# Altium project MSXIV_Rear_Power_Distribution.PrjPcb (part 5 of 5)

## Sheet Power Distribution -  Rear Camera and Charger.SchDoc: Title
size B; Organization: Midnight Sun Solar Rayce Car Team; Address1: University of Waterloo; Address2: 200 University Ave W; Address3: Waterloo, ON, Canada; Address4: N2L 3E9; Website: www.uwmidsun.com; ProjectName: ProjectName
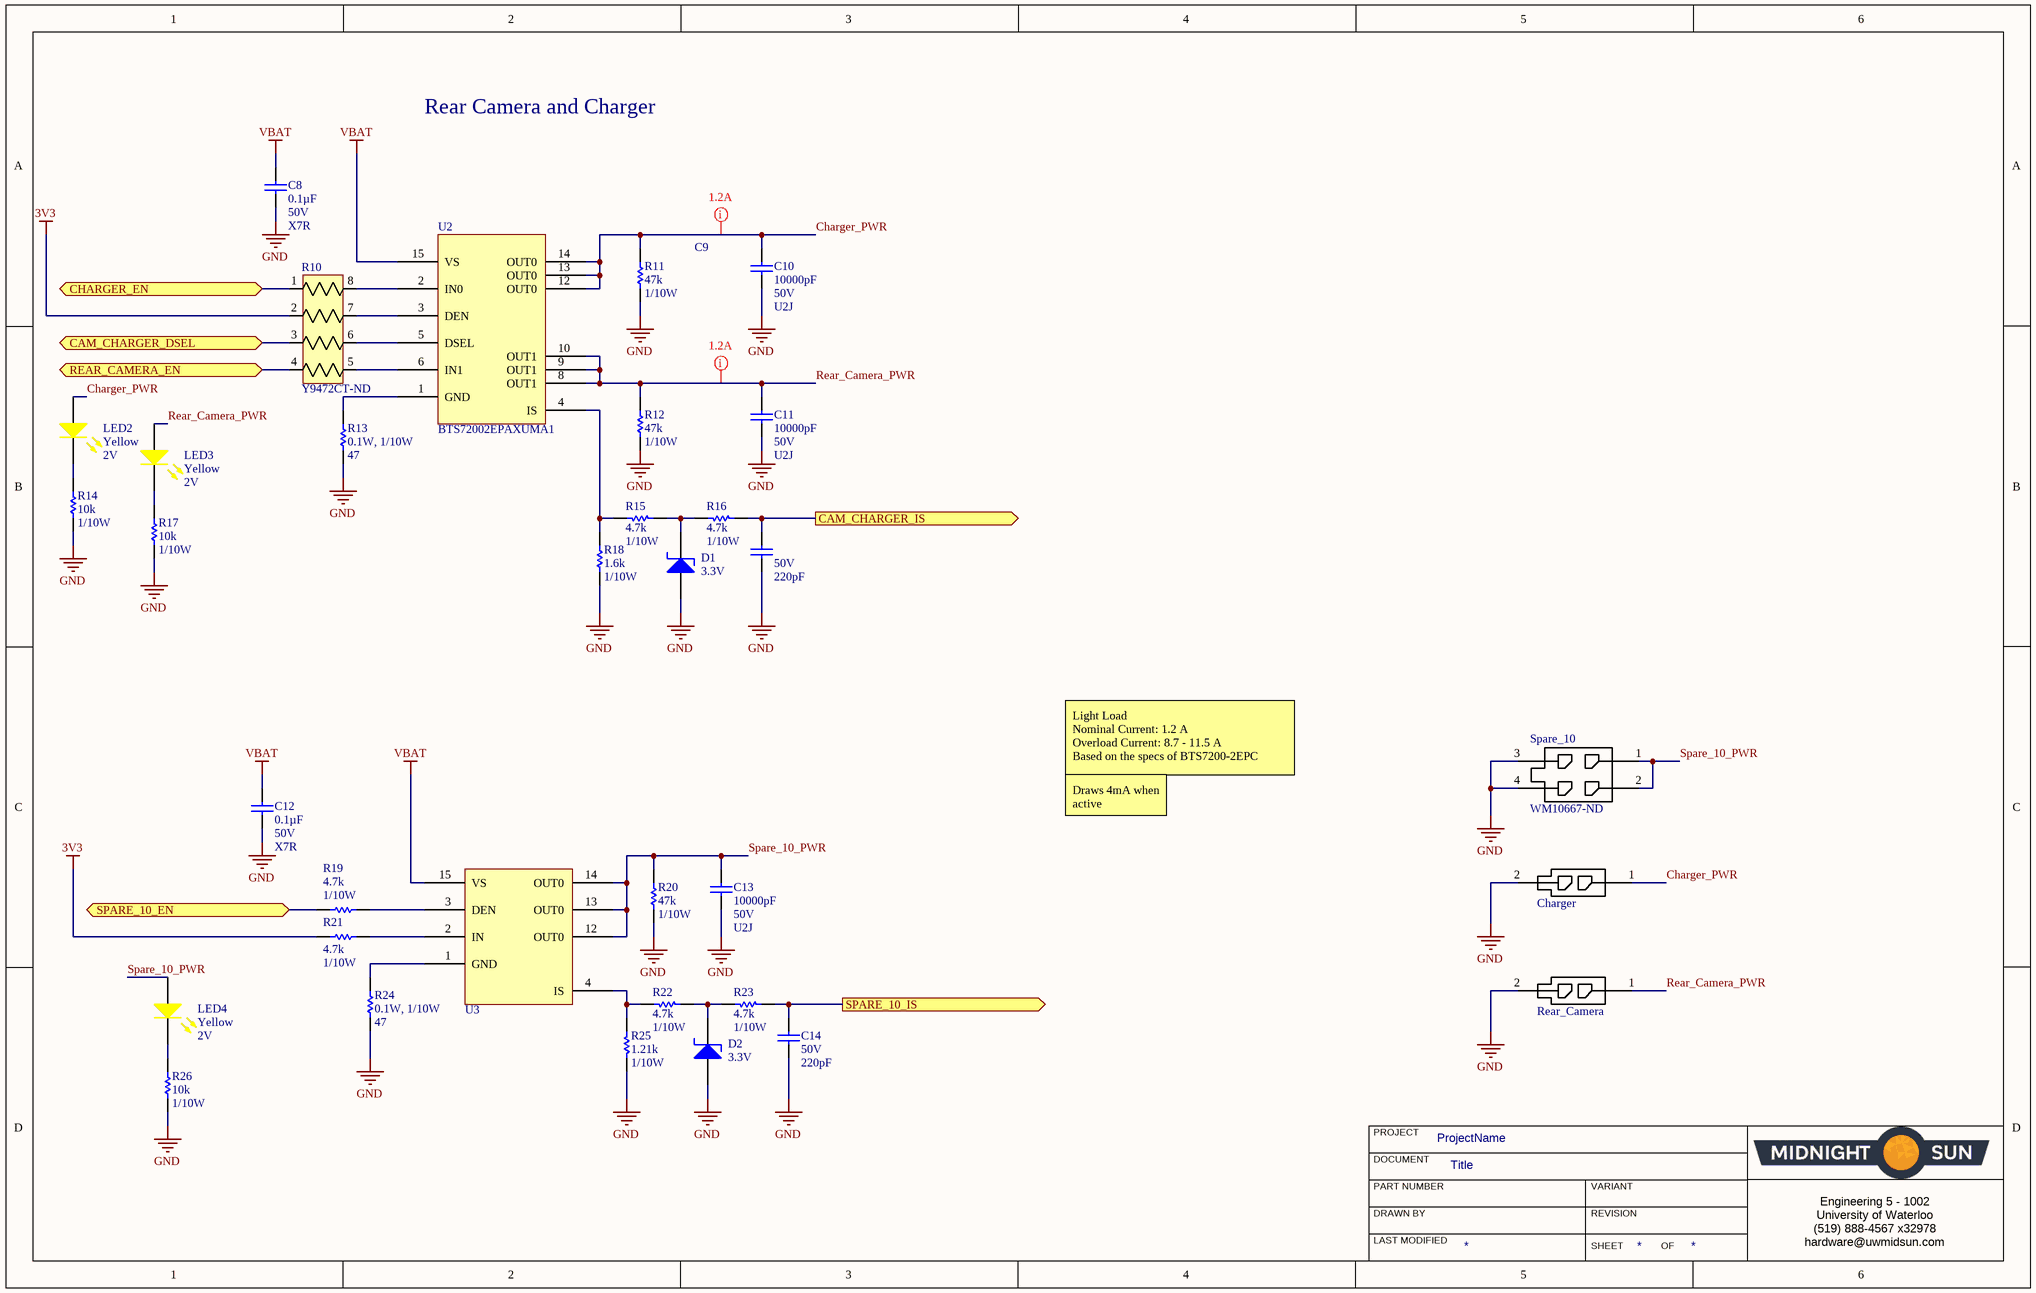
[diagram p8: Power Distribution -  Rear Camera and Charger.SchDoc]

### Parts
C8  Capacitance: 0.1µF  Voltage: 50V  Temperature Coefficient: X7R  [CAP, 0603]  (hidden comment: CAP CER 0.1UF 50V 10% X7R 0603)
C9  Voltage Rating: 50V  Capacitance: 220pF  [CAP, 0603]  (hidden comment: CAP CER 220PF 50V C0G/NP0 0603)
C10  Capacitance: 10000pF  Voltage: 50V  Temperature Coefficient: U2J  [CAP, 0603]  (hidden comment: CAP CER 10nF 50V 5% X7R 0603)
C11  Capacitance: 10000pF  Voltage: 50V  Temperature Coefficient: U2J  [CAP, 0603]  (hidden comment: CAP CER 10nF 50V 5% X7R 0603)
C12  Capacitance: 0.1µF  Voltage: 50V  Temperature Coefficient: X7R  [CAP, 0603]  (hidden comment: CAP CER 0.1UF 50V 10% X7R 0603)
C13  Capacitance: 10000pF  Voltage: 50V  Temperature Coefficient: U2J  [CAP, 0603]  (hidden comment: CAP CER 10nF 50V 5% X7R 0603)
C14  Voltage Rating: 50V  Capacitance: 220pF  [CAP, 0603]  (hidden comment: CAP CER 220PF 50V C0G/NP0 0603)
Charger  CONN 2POS MICRO-FIT 3mm  [CONN, 2POS MICRO-FIT]  (value not drawn)
D1  Voltage: 3.3V  [sod-323]  (hidden comment: DIODE ZENER 3.3V 200MW SOD323)
D2  Voltage: 3.3V  [sod-323]  (hidden comment: DIODE ZENER 3.3V 200MW SOD323)
LED2  Color: Yellow  Voltage - Forward (Vf) (Typ): 2V  [LED_0603]  (hidden comment: LED YELLOW CLEAR 2.1V 0603)
LED3  Color: Yellow  Voltage - Forward (Vf) (Typ): 2V  [LED_0603]  (hidden comment: LED YELLOW CLEAR 2.1V 0603)
LED4  Color: Yellow  Voltage - Forward (Vf) (Typ): 2V  [LED_0603]  (hidden comment: LED YELLOW CLEAR 2.1V 0603)
R10  Supplier Part Number 1: Y9472CT-ND  [RES ARRAY 4RES 1206]  (hidden comment: RES ARRAY 4 RES 4.7K OHM 1206)
R11  Resistance: 47k  Power Rating: 1/10W  [RES, 0603]  (hidden comment: RES 47K OHM 1% 1/10W 0603)
R12  Resistance: 47k  Power Rating: 1/10W  [RES, 0603]  (hidden comment: RES 47K OHM 1% 1/10W 0603)
R13  Power (Watts): 0.1W, 1/10W  Values: 47  [RES, 0603]  (hidden comment: RES SMD 47 OHM 1% 1/10W 0603)
R14  Resistance: 10k  Power: 1/10W  [RES, 0603]  (hidden comment: RES 10K OHM 1% 1/10W 0603)
R15  Resistance (Ohms): 4.7k  Power (Watts): 1/10W  [RES, 0603]  (hidden comment: RES 4.7K OHM 1% 1/10W 0603)
R16  Resistance (Ohms): 4.7k  Power (Watts): 1/10W  [RES, 0603]  (hidden comment: RES 4.7K OHM 1% 1/10W 0603)
R17  Resistance: 10k  Power: 1/10W  [RES, 0603]  (hidden comment: RES 10K OHM 1% 1/10W 0603)
R18  Resistance: 1.6k  Power Rating: 1/10W  [RES, 0603]  (hidden comment: RES 1.6K OHM 1% 1/10W 0603)
R19  Resistance (Ohms): 4.7k  Power (Watts): 1/10W  [RES, 0603]  (hidden comment: RES 4.7K OHM 1% 1/10W 0603)
R20  Resistance: 47k  Power Rating: 1/10W  [RES, 0603]  (hidden comment: RES 47K OHM 1% 1/10W 0603)
R21  Resistance (Ohms): 4.7k  Power (Watts): 1/10W  [RES, 0603]  (hidden comment: RES 4.7K OHM 1% 1/10W 0603)
R22  Resistance (Ohms): 4.7k  Power (Watts): 1/10W  [RES, 0603]  (hidden comment: RES 4.7K OHM 1% 1/10W 0603)
R23  Resistance (Ohms): 4.7k  Power (Watts): 1/10W  [RES, 0603]  (hidden comment: RES 4.7K OHM 1% 1/10W 0603)
R24  Power (Watts): 0.1W, 1/10W  Values: 47  [RES, 0603]  (hidden comment: RES SMD 47 OHM 1% 1/10W 0603)
R25  Resistance: 1.21k  Power: 1/10W  [RES, 0603]  (hidden comment: RES 1.21K OHM 1% 1/10W 0603)
R26  Resistance: 10k  Power: 1/10W  [RES, 0603]  (hidden comment: RES 10K OHM 1% 1/10W 0603)
Rear_Camera  CONN 2POS MICRO-FIT 3mm  [CONN, 2POS MICRO-FIT]  (value not drawn)
Spare_10  Supplier Part Number 1: WM10667-ND  [CONN 4POS MICROFIT (2x2)]  (hidden comment: CONN 4POS MICRO-FIT 3mm)
U2  Manufacturer Part Number: BTS72002EPAXUMA1  [IC LOAD SWITCH PG-TSDSO-14-22]  (hidden comment: IC LOAD SWITCH BTS7200-2EPA PG-TSDSO-14_1)
U3  IC LOAD SWITCH BTS70401EPA PG-TSDSO-14-22  [IC LOAD SWITCH PG-TSDSO-14-22]  (value not drawn)

### Ports
CAM_CHARGER_DSEL (bidir), CAM_CHARGER_IS (out), CHARGER_EN (bidir), REAR_CAMERA_EN (bidir), SPARE_10_EN (bidir), SPARE_10_IS (out)

### Nets
3V3: R10.2 R21.1
GND: C8.2 C9.2 C10.2 C11.2 C12.2 C13.2 C14.2 Charger.2 D1.1(A) D2.1(A) R11.2 R12.2 R13.2 R14.2 R17.2 R18.2 R20.2 R24.2 R25.2 R26.2 Rear_Camera.2 Spare_10.3 Spare_10.4
VBAT: C8.1 C12.1 U2.15(VS) U3.15(VS)
Charger_PWR: C10.1 Charger.1 LED2.1(A) R11.1 U2.12(OUT0) U2.13(OUT0) U2.14(OUT0)
Rear_Camera_PWR: C11.1 LED3.1(A) R12.1 Rear_Camera.1 U2.8(OUT1) U2.9(OUT1) U2.10(OUT1)
Spare_10_PWR: C13.1 LED4.1(A) R20.1 Spare_10.1 Spare_10.2 U3.12(OUT0) U3.13(OUT0) U3.14(OUT0)
NetC9_1: C9.1 R16.1 ; port CAM_CHARGER_IS
NetC14_1: C14.1 R23.1 ; port SPARE_10_IS
NetD1_2: D1.2(K) R15.1 R16.2
NetD2_2: D2.2(K) R22.1 R23.2
NetLED2_2: LED2.2(K) R14.1
NetLED3_2: LED3.2(K) R17.1
NetLED4_2: LED4.2(K) R26.1
NetR10_1: R10.1 ; port CHARGER_EN
NetR10_3: R10.3 ; port CAM_CHARGER_DSEL
NetR10_4: R10.4 ; port REAR_CAMERA_EN
NetR10_5: R10.5 U2.6(IN1)
NetR10_6: R10.6 U2.5(DSEL)
NetR10_7: R10.7 U2.3(DEN)
NetR10_8: R10.8 U2.2(IN0)
NetR13_1: R13.1 U2.1(GND)
NetR15_2: R15.2 R18.1 U2.4(IS)
NetR19_1: R19.1 ; port SPARE_10_EN
NetR19_2: R19.2 U3.3(DEN)
NetR21_2: R21.2 U3.2(IN)
NetR22_2: R22.2 R25.1 U3.4(IS)
NetR24_1: R24.1 U3.1(GND)

### Layout directives
mark named 1.2A: Charger_PWR, Rear_Camera_PWR

### Notes on the sheet
- Rear Camera and Charger
- Light Load
  Nominal Current: 1.2 A
  Overload Current: 8.7 - 11.5 A
  Based on the specs of BTS7200-2EPC
- Draws 4mA when active
- PROJECT
- DOCUMENT
- DRAWN BY
- LAST MODIFIED
- PART NUMBER
- REVISION
- SHEET
- VARIANT
- OF
- Engineering 5 - 1002
  University of Waterloo
  (519) 888-4567 x32978
  hardware@uwmidsun.com

### Library data of the parts
C8 C12 = CAP CER 0.1UF 50V 10% X7R 0603: 0.10µF ±10% 50V Ceramic Capacitor X7R 0603 (1608 Metric); Manufacturer 1: AVX Corporation; Manufacturer Part Number 1: 06035C104KAT2A; Supplier 1: Digi-Key; Supplier Part Number 1: 478-5052-1-ND; Packaging: Cut Tape (CT); Part Status: Active; Operating Temperature: -55°C ~ 125°C; Ratings: -; Mounting Type: Surface Mount, MLCC; Package / Case: 0603 (1608 Metric); Size / Dimension: 0.063" L x 0.032" W (1.60mm x 0.81mm); Height - Seated (Max): -; Thickness (Max): 0.035" (0.90mm); Lead Spacing: -; Lead Style: -; ComponentLink1URL: http://datasheets.avx.com/X7RDielectric.pdf; ComponentLink1Description: http://datasheets.avx.com/X7RDielectric.pdf; Tolerance: ±10%
C9 C14 = CAP CER 220PF 50V C0G/NP0 0603: 220pF ±5% 50V Ceramic Capacitor C0G, NP0 0603 (1608 Metric); Manufacturer: KEMET; Manufacturer Part Number: C0603C221J5GACAUTO; Dissipation Factor: 0.1%; Supplier 1: Digi-Key; Supplier Part Number 1: 399-6868-1-ND; Stock 1: 35170; Pricing 1: 1=0.14000, 10=0.09700, 100=0.04550, 500=0.03188, 1000=0.02640 (USD); RoHS: Yes; Mount: Surface Mount; Case/Package: 0603; Case Code (Metric): 1608; Case Code (Imperial): 0603; Contact Plating: Tin; Dielectric Material: Ceramic; Min Operating Temperature: -55°C; Max Operating Temperature: 125°C; Tolerance: 5%; Packaging: Tape and Reel; Package Quantity: 1; Voltage Rating (DC): 50V; Termination: SMD/SMT; Length: 1.6mm; Height: 0.8mm; Width: 0.031inch; Thickness: 0.034inch; Depth: 0.8mm; Ratings: AEC-Q200; Radiation Hardening: No; REACH SVHC: No SVHC; Lead Free: Lead Free; ComponentLink1URL: https://datasheet.ciiva.com/18192/getdatasheetpartid-416741-18192869.pdf?src-supplier=Verical; ComponentLink1Description: https://datasheet.ciiva.com/18192/getdatasheetpartid-416741-18192869.pdf?src-supplier=Verical; ComponentLink2URL: https://datasheet.ciiva.com/22694/1633156-22694015.pdf?src-supplier=Element14; ComponentLink2Description: https://datasheet.ciiva.com/22694/1633156-22694015.pdf?src-supplier=Element14; Dielectric: C0G
C10 C11 C13 = CAP CER 10nF 50V 5% X7R 0603: as C27-C29 on sheet Power Distribution - Rear Turn and Brake Lights; Supplier 1: Digi-Key; Supplier Part Number 1: 399-13384-1-ND; Packaging: Cut Tape (CT); Part Status: Active; Operating Temperature: -55°C ~ 125°C; Ratings: -; Failure Rate: -; Mounting Type: Surface Mount, MLCC; Package / Case: 0603 (1608 Metric); Size / Dimension: 0.063" L x 0.032" W (1.60mm x 0.80mm); Height - Seated (Max): -; Thickness (Max): 0.034" (0.87mm); Lead Spacing: -; Lead Style: -; ComponentLink1URL: http://www.kemet.com/docfinder?Partnumber=C0603C103J5JAC7867; ComponentLink1Description: http://www.kemet.com/docfinder?Partnumber=C0603C103J5JAC7867; Tolerance: ±5%
Charger Rear_Camera = CONN 2POS MICRO-FIT 3mm: Connector Header Through Hole 2 position; Manufacturer: Molex; Manufacturer Part Number: 43045-0227; Number of Positions: 2; Gender: Male; Contact Resistance: 10mR; Number of Ports: 1; Max Voltage Rating (DC): 250.25kV; Current Rating: 5A; Voltage Rating: 600V; Glow Wire Compliant: Compliant; Supplier 1: Digi-Key; Stock 1: 3657; Pricing 1: 1=0.84, 10=0.74, 25=0.6968, 50=0.6676, 100=0.6387, 250=0.5806, 500=0.52254, 1000=0.46448, 2500=0.42094 (USD); Mount: Through Hole; Contact Plating: Tin; Contact Material: Brass; Housing Colour: Black; Housing Material: Thermoplastic; Number of Terminals: 2; Min Operating Temperature: -40°C; Max Operating Temperature: 105°C; Number of Rows: 2; Packaging: Tray; Termination: Solder; Number of Contacts: 2; Orientation: Vertical; Package Quantity: 3168; Number of Circuits: 2; Length: 7.15mm; Pitch: 3mm; Depth: 8.77mm; Row Spacing: 3mm; Radiation Hardening: No; Halogen Free: Low Halogen; ComponentLink1URL: http://www.onlinecomponents.com/productFiles/mf-MOL/307170430450227_pcb_headers.pdf; ComponentLink1Description: http://www.onlinecomponents.com/productFiles/mf-MOL/307170430450227_pcb_headers.pdf; ComponentLink2URL: http://www.mouser.com/ds/2/276/0430450227_PCB_HEADERS-142611.pdf; ComponentLink2Description: http://www.mouser.com/ds/2/276/0430450227_PCB_HEADERS-142611.pdf; ComponentLink3URL: http://uk.rs-online.com/webdocs/13c3/0900766b813c3a46.pdf; ComponentLink3Description: http://uk.rs-online.com/webdocs/13c3/0900766b813c3a46.pdf; ComponentLink4URL: http://www.molex.com/webdocs/datasheets/pdf/en-us/0430450227_PCB_HEADERS.pdf; ComponentLink4Description: http://www.molex.com/webdocs/datasheets/pdf/en-us/0430450227_PCB_HEADERS.pdf; Supplier Part Number 1: WM10657-ND
D1 D2 = DIODE ZENER 3.3V 200MW SOD323: as D6-D8 on sheet Power Distribution - Rear Turn and Brake Lights; ComponentLink1Description: http://www.vishay.com/docs/85764/bzx384.pdf; ComponentLink1URL: http://www.vishay.com/docs/85764/bzx384.pdf; Supplier 1: Digi-Key; Supplier Part Number 1: BZX384C3V3-E3-08GICT-ND
LED2-LED4 = LED YELLOW CLEAR 2.1V 0603: as LED9-LED13 on sheet Power Distribution - Rear Turn and Brake Lights; Supplier 1: Digi-Key; RoHS: RoHS Compliant; Category: Optoelectronics; Stock 1: 10523; Pricing 1: 1=0.21, 100=0.1617, 500=0.13964 (CAD); Packaging: Cut Tape (CT); Part Status: Active; Lens Transparency: Clear; Mounting Type: Surface Mount; Wavelength - Dominant: 590nm; Features: -; Package / Case: 0603 (1608 Metric); Supplier Device Package: 0603; Size / Dimension: 1.60mm L x 0.80mm W; Height (Max): 0.80mm; ComponentLink1URL: http://katalog.we-online.de/led/datasheet/150060YS75000.pdf; ComponentLink1Description: http://katalog.we-online.de/led/datasheet/150060YS75000.pdf; Supplier Part Number 1: 732-4981-1-ND
R10 = RES ARRAY 4 RES 4.7K OHM 1206: 4.7k Ohm ±5% 62.5mW Power Per Element Isolated 4 Resistor Network/Array ±200ppm/°C 1206 (3216 Metric), Convex, Long Side Terminals; Number of Resistors: 4; Applications Automotive: AEC-Q200; Applications: -; Category: Resistors; Circuit Type: Isolated; Part Status: Active; Resistance (Ohms): 4.7k; Tolerance: ±5%; Power Per Element: 62.5mW; Number of Pins: 8; Operating Temperature: -55°C ~ 125°C; Mounting Type: Surface Mount; Package / Case: 1206 (3216 Metric), Convex, Long Side Terminals; Supplier Device Package: 1206; Size / Dimension: 0.126" L x 0.063" W (3.20mm x 1.60mm); Height - Seated (Max): 0.024" (0.60mm); Packaging: Cut Tape (CT); Resistor Matching Ratio: -; Resistor-Ratio-Drift: -; Series: EXB; ComponentLink1Description: https://industrial.panasonic.com/cdbs/www-data/pdf/AOC0000/AOC0000C14.pdf; ComponentLink1URL: https://industrial.panasonic.com/cdbs/www-data/pdf/AOC0000/AOC0000C14.pdf; Supplier 1: Digi-Key; Temperature Coefficient: ±200ppm/°C
R11 R12 R20 = RES 47K OHM 1% 1/10W 0603: 47 kOhms ±1% 0.1W, 1/10W Chip Resistor 0603 (1608 Metric) Automotive AEC-Q200 Thick Film; Manufacturer: Panasonic; Manufacturer Part Number: ERJ3EKF4702V; Voltage Rating: 75V; Temperature Coefficient: 100ppm/°C; Working Voltage: 6V; Max Power Dissipation: 100mW; ComponentLink1URL: https://industrial.panasonic.com/cdbs/www-data/pdf/RDO0000/AOA0000C291.pdf; ComponentLink1Description: https://industrial.panasonic.com/cdbs/www-data/pdf/RDO0000/AOA0000C291.pdf; ComponentLink2URL: https://datasheet.ciiva.com/6138/aoa0000ce2-6138149.pdf?src-supplier=Farnell; ComponentLink2Description: https://datasheet.ciiva.com/6138/aoa0000ce2-6138149.pdf?src-supplier=Farnell; ComponentLink3URL: https://datasheet.ciiva.com/7802/aoa0000ce2-7802421.pdf?src-supplier=Element14; ComponentLink3Description: https://datasheet.ciiva.com/7802/aoa0000ce2-7802421.pdf?src-supplier=Element14; ComponentLink4URL: https://datasheet.ciiva.com/48531/aoa0000ce2-48531029.pdf?src-supplier=Avnet; ComponentLink4Description: https://datasheet.ciiva.com/48531/aoa0000ce2-48531029.pdf?src-supplier=Avnet; ComponentLink5URL: https://datasheet.ciiva.com/16514/aoa0000ce2-16514071.pdf?src-supplier=Avnet+Asia; ComponentLink5Description: https://datasheet.ciiva.com/16514/aoa0000ce2-16514071.pdf?src-supplier=Avnet+Asia; ComponentLink6URL: https://datasheet.ciiva.com/46398/1678782-46398088.pdf?src-supplier=Element14; ComponentLink6Description: https://datasheet.ciiva.com/46398/1678782-46398088.pdf?src-supplier=Element14; ComponentLink7URL: https://datasheet.ciiva.com/24069/aoa0000ce2-24069209.pdf?src-supplier=Mouser; ComponentLink7Description: https://datasheet.ciiva.com/24069/aoa0000ce2-24069209.pdf?src-supplier=Mouser; ComponentLink8URL: https://datasheet.ciiva.com/46398/1678782-46398089.pdf?src-supplier=Element14; ComponentLink8Description: https://datasheet.ciiva.com/46398/1678782-46398089.pdf?src-supplier=Element14; ComponentLink9URL: https://datasheet.ciiva.com/30236/aoa0000ce2-30236698.pdf?src-supplier=Onlinecomponents.com; ComponentLink9Description: https://datasheet.ciiva.com/30236/aoa0000ce2-30236698.pdf?src-supplier=Onlinecomponents.com; ComponentLink10URL: https://datasheet.ciiva.com/22722/426256-22722781.pdf?src-supplier=Element14; ComponentLink10Description: https://datasheet.ciiva.com/22722/426256-22722781.pdf?src-supplier=Element14; ComponentLink11URL: https://datasheet.ciiva.com/16758/70260748-16758831.pdf?src-supplier=Allied+Electronics; ComponentLink11Description: https://datasheet.ciiva.com/16758/70260748-16758831.pdf?src-supplier=Allied+Electronics; Supplier 1: Digi-Key; Stock 1: 1704740; Pricing 1: 1 = 0.100000, 10 = 0.065000, 100 = 0.026400, 1000 = 0.011860, 2500 = 0.010290 (USD); RoHS: Yes; Mount: Surface Mount; Case/Package: 0603; Number of Pins: 2; Case Code (Metric): 1608; Case Code (Imperial): 0603; Contact Plating: Tin; Min Operating Temperature: -55°C; Max Operating Temperature: 155°C; Tolerance: 1%; Packaging: Tape and Reel; Package Quantity: 1; Composition: Thick Film; Number of Terminations: 2; Termination: SMD/SMT; Military Standard: Not; Voltage Rating (DC): 75V; Features: Automotive AEC-Q200; Length: 1.6mm; Height: 0.022inch; Width: 0.031inch; Depth: 0.8mm; Radiation Hardening: No; REACH SVHC: No SVHC; Lead Free: Lead Free; Supplier Part Number 1: P47.0KHCT-ND
R13 R24 = RES SMD 47 OHM 1% 1/10W 0603: 47 Ohms ±1% 0.1W, 1/10W Chip Resistor 0603 (1608 Metric) Automotive AEC-Q200, Moisture Resistant Thick Film; Temperature Coefficient: ±100ppm/°C; Resistance: 47 Ohms; Operating Temperature: -55°C ~ 155°C; Features: Automotive AEC-Q200, Moisture Resistant; Tolerance: ±1%; Composition: Thick Film; Ratings: AEC-Q200; Package / Case: 0603 (1608 Metric); Number of Terminations: 2; Height - Seated (Max): 0.022" (0.55mm); Size / Dimension: 0.063" L x 0.031" W (1.60mm x 0.80mm); ComponentLink1Description: https://www.yageo.com/upload/media/product/productsearch/datasheet/rchip/PYu-AC_51_RoHS_L_7.pdf; ComponentLink1URL: https://www.yageo.com/upload/media/product/productsearch/datasheet/rchip/PYu-AC_51_RoHS_L_7.pdf; Supplier 1: Digi-Key; Supplier Part Number 1: 311-47LDCT-ND; Supplier Device Package: 0603
R14 R17 R26 = RES 10K OHM 1% 1/10W 0603: RES SMD 10K OHM 1% 1/10W 0603; Manufacturer 1: Yageo; Manufacturer Part Number 1: RC0603FR-0710KL; Temperature Coefficient: ±100ppm/°C; Supplier 1: Digi-Key; Supplier Part Number 1: 311-10.0KHRCT-ND; Packaging: Cut Tape (CT); Part Status: Active; Composition: Thick Film; Operating Temperature: -55°C ~ 155°C; Package / Case: 0603 (1608 Metric); Supplier Device Package: 0603; Size / Dimension: 0.063" L x 0.031" W (1.60mm x 0.80mm); Height - Seated (Max): 0.022" (0.55mm); Failure Rate: -; ComponentLink1URL: http://www.yageo.com/documents/recent/PYu-RC_Group_51_RoHS_L_7.pdf; ComponentLink1Description: http://www.yageo.com/documents/recent/PYu-RC_Group_51_RoHS_L_7.pdf; Tolerance: ±1%
R15 R16 R19 R21-R23 = RES 4.7K OHM 1% 1/10W 0603: 4.7k Ohm ±1% 0.1W, 1/10W Chip Resistor 0603 (1608 Metric) Moisture Resistant Thick Film; Manufacturer 1: Yageo; Manufacturer Part Number 1: RC0603FR-074K7L; Description 1: RES SMD 4.7K OHM 1% 1/10W 0603; Temperature Coefficient: ±100ppm/°C; Supplier 1: Digi-Key; Supplier Part Number 1: 311-4.70KHRCT-ND; RoHS: RoHS Compliant; Category: Resistors; Stock 1: 3487566; Pricing 1: 1=0.16, 10=0.022, 100=0.0089, 1000=0.00402, 2500=0.00349 (CAD); Packaging: Cut Tape (CT); Part Status: Active; Composition: Thick Film; Features: Moisture Resistant; Operating Temperature: -55°C ~ 155°C; Package / Case: 0603 (1608 Metric); Supplier Device Package: 0603; Size / Dimension: 0.063" L x 0.031" W (1.60mm x 0.80mm); Height - Seated (Max): 0.022" (0.55mm); Failure Rate: -; ComponentLink1URL: http://www.yageo.com/documents/recent/PYu-RC_Group_51_RoHS_L_7.pdf; ComponentLink1Description: http://www.yageo.com/documents/recent/PYu-RC_Group_51_RoHS_L_7.pdf; Tolerance: ±1%
R18 = RES 1.6K OHM 1% 1/10W 0603: 1.6 kOhms ±1% 0.1W, 1/10W Chip Resistor 0603 (1608 Metric) Moisture Resistant Thick Film; Manufacturer: Yageo; Manufacturer Part Number: RC0603FR-071K6L; Voltage Rating: 50V; Temperature Coefficient: 100ppm/°C; Working Voltage: 75V; Supplier 1: Digi-Key; Stock 1: 189550; Pricing 1: 1=0.1, 10=0.015, 100=0.006, 1000=0.0027, 2500=0.0023 (USD); Case/Package: 0603; Case Code (Imperial): 0603; Case Code (Metric): 1608; Min Operating Temperature: -55°C; Max Operating Temperature: 155°C; Tolerance: 1%; Packaging: Tape and Reel; Termination: SMD/SMT; Composition: Thick Film; Military Standard: Not; Voltage Rating (DC): 50V; Number of Terminations: 2; Length: 1.6mm; Depth: 0.8mm; Lead Free: Lead Free; ComponentLink1URL: http://components.arrow.com/part/dataview/0323_00200779; ComponentLink1Description: http://components.arrow.com/part/dataview/0323_00200779; ComponentLink2URL: http://www.yageo.com.tw/exep/pages/download/literatures/PYu-R_INT-thick_7.pdf; ComponentLink2Description: http://www.yageo.com.tw/exep/pages/download/literatures/PYu-R_INT-thick_7.pdf; ComponentLink3URL: http://www.mouser.com/ds/2/447/RC0603-272842.pdf; ComponentLink3Description: http://www.mouser.com/ds/2/447/RC0603-272842.pdf; ComponentLink4URL: http://www.yageo.com/documents/recent/PYu-RC0603_51_RoHS_L_v5.pdf; ComponentLink4Description: http://www.yageo.com/documents/recent/PYu-RC0603_51_RoHS_L_v5.pdf; Supplier Part Number 1: 311-1.60KHRCT-ND
R25 = RES 1.21K OHM 1% 1/10W 0603: 1.21k Ohm ±1% 0.1W, 1/10W Chip Resistor 0603 (1608 Metric) Moisture Resistant Thick Film; Manufacturer 1: Yageo; Manufacturer Part Number 1: RC0603FR-071K21L; Temperature Coefficient: ±100ppm/°C; Supplier 1: Digi-Key; Supplier Part Number 1: 311-1.21KHRCT-ND; Packaging: Cut Tape (CT); Part Status: Active; Composition: Thick Film; Operating Temperature: -55°C ~ 155°C; Package / Case: 0603 (1608 Metric); Supplier Device Package: 0603; Size / Dimension: 0.063" L x 0.031" W (1.60mm x 0.80mm); Height - Seated (Max): 0.022" (0.55mm); Failure Rate: -; ComponentLink1URL: http://www.yageo.com/documents/recent/PYu-RC_Group_51_RoHS_L_7.pdf; ComponentLink1Description: http://www.yageo.com/documents/recent/PYu-RC_Group_51_RoHS_L_7.pdf; Tolerance: ±1%
Spare_10 = CONN 4POS MICRO-FIT 3mm: Micro-Fit 3.0 Vertical Header, 3.00mm Pitch, Dual Row, 4 Circuits, with PCB Polarizing Peg, Tin, Glow-Wire Capable, Black; Manufacturer: Molex, LLC; Manufacturer Part Number: 430450427; Pitch - Mating: 0.118" (3.00mm); Number of Positions: 6; Number of Positions Loaded: All; Style: Board to Cable/Wire; Shrouding: Shrouded - 4 Wall; Contact Length - Post: 0.125" (3.18mm); Material Flammability Rating: UL94 V-0; Contact Resistance: 10mR; Number of Contacts: 4; Number of Ports: 1; Row Spacing: 0.118inch; RoHS: RoHS Compliant; Category: Connectors, Interconnects; Packaging: Tray; Part Status: Active; Connector Type: Header; Contact Type: Male Pin; Number of Rows: 2; Row Spacing - Mating: 0.118" (3.00mm); Mounting Type: Through Hole; Termination: Solder; Fastening Type: Locking Ramp; Contact Length - Mating: -; Overall Contact Length: -; Insulation Height: 0.390" (9.91mm); Contact Shape: Square; Contact Finish - Mating: Tin; Contact Finish Thickness - Mating: 60.0µin (1.52µm); Contact Finish - Post: Tin; Contact Material: Brass; Insulation Material: Liquid Crystal Polymer (LCP), Glass Filled; Features: Board Guide; Operating Temperature: -; Ingress Protection: -; Insulation Color: Black; Current Rating: -; Voltage Rating: -; Mated Stacking Heights: -; Contact Finish Thickness - Post: -; Applications: General Purpose, Medical, Military, Telecommunications; Mount: Through Hole; Contact Plating: Tin; Housing Material: Polymer; Color: Black; Number of Terminals: 4; Housing Color: Black; Min Operating Temperature: -40°C; Max Operating Temperature: 105°C; Package Quantity: 2232; Orientation: Straight; Length: 10.15mm; Pitch: 3mm; Depth: 8.77mm; ComponentLink4URL: http://www.molex.com/webdocs/datasheets/pdf/en-us/0430450427_PCB_HEADERS.pdf; ComponentLink4Description: http://www.molex.com/webdocs/datasheets/pdf/en-us/0430450427_PCB_HEADERS.pdf; Supplier 1: Digi-Key
U2 = IC LOAD SWITCH BTS7200-2EPA PG-TSDSO-14_1: Power Switch/Driver 1:1 N-Channel 1.2A PG-TSDSO-14-22; Manufacturer: Infineon; Supplier 1: Digi-Key; Supplier Part Number 1: BTS72002EPAXUMA1CT-ND; Stock 1: 1973; Pricing 1: 1=1.31000, 10=1.17500, 100=0.91640, 500=0.75700, 1000=0.59763 (USD); RoHS: No; ComponentLink1Description: https://www.infineon.com/dgdl/Infineon-BTS7200-2EPA-DS-v01_00-EN.pdf?fileId=5546d462636cc8fb016421e548a61215; ComponentLink1URL: https://www.infineon.com/dgdl/Infineon-BTS7200-2EPA-DS-v01_00-EN.pdf?fileId=5546d462636cc8fb016421e548a61215
U3 = IC LOAD SWITCH BTS70401EPA PG-TSDSO-14-22: Power Switch/Driver 1:1 N-Channel 4.5A PG-TSDSO-14-22; Manufacturer: Infineon; Manufacturer Part Number: BTS70401EPAXUMA1; ComponentLink1Description: https://www.infineon.com/dgdl/Infineon-BTS7040-1EPA-DS-v01_00-EN.pdf?fileId=5546d462636cc8fb0163fe8f965308bc; ComponentLink1URL: https://www.infineon.com/dgdl/Infineon-BTS7040-1EPA-DS-v01_00-EN.pdf?fileId=5546d462636cc8fb0163fe8f965308bc; Supplier 1: Digi-Key; Supplier Part Number 1: BTS70401EPAXUMA1CT-ND

## Nets that join several sheets
3V3: Controller_Board_Interface (8 pins), Power Distribution - IO Expander (11 pins), Power Distribution - Strobe and Center Brake Lights (R27.1 R30.2 R44.1), Power Distribution - Spares 8-9 5V (R115.2), Power Distribution - Motor Interface (R125.1), Power Distribution - Spares 1-4 5V (R80.2 R89.2), Power Distribution - Rear Turn and Brake Lights (R54.1 R55.2 R69.2), Power Distribution - Solar Sense, Telemetry, and BMS (R100.1 R102.2), Power Distribution -  Rear Camera and Charger (R10.2 R21.1)
+5V: Controller_Board_Interface (6 pins), Power Distribution - Spares 8-9 5V (C54.1 U17.15), Power Distribution - Spares 1-4 5V (C39.1 C43.1 U13.15 U14.15)
GND: Controller_Board_Interface (21 pins), Power Distribution - IO Expander (9 pins), Power Distribution - Strobe and Center Brake Lights (32 pins), Power Distribution - Spares 8-9 5V (13 pins), Power Distribution - Motor Interface (9 pins), Power Distribution - Spares 1-4 5V (26 pins), Power Distribution - Rear Turn and Brake Lights (36 pins), Power Distribution - Solar Sense, Telemetry, and BMS (22 pins), Power Distribution -  Rear Camera and Charger (23 pins)
VBAT: Controller_Board_Interface (8 pins), Power Distribution - Strobe and Center Brake Lights (6 pins), Power Distribution - Motor Interface (C58.1 U18.15), Power Distribution - Rear Turn and Brake Lights (6 pins), Power Distribution - Solar Sense, Telemetry, and BMS (C47.1 C48.1 U15.15 U16.15), Power Distribution -  Rear Camera and Charger (C8.1 C12.1 U2.15 U3.15)
IO_EX_I2C_SCL: Controller_Board_Interface (I2C_SCL.TP P1.14 R8.2), Power Distribution - IO Expander (U10.23 U12.23)
IO_EX_I2C_SDA: Controller_Board_Interface (I2C_SDA.TP P1.13 R9.2), Power Distribution - IO Expander (U10.22 U12.22)
NetC9_1: Power Distribution - IO Expander (U11.22), Power Distribution -  Rear Camera and Charger (C9.1 R16.1)
NetC14_1: Power Distribution - IO Expander (U11.23), Power Distribution -  Rear Camera and Charger (C14.1 R23.1)
NetC19_1: Power Distribution - IO Expander (U11.6), Power Distribution - Strobe and Center Brake Lights (C19.1 R34.1)
NetC22_1: Power Distribution - IO Expander (U11.3), Power Distribution - Strobe and Center Brake Lights (C22.1 R40.1)
NetC24_1: Power Distribution - IO Expander (U11.4), Power Distribution - Strobe and Center Brake Lights (C24.1 R49.1)
NetC30_1: Power Distribution - IO Expander (U11.18), Power Distribution - Rear Turn and Brake Lights (C30.1 R59.1)
NetC31_1: Power Distribution - IO Expander (U11.9), Power Distribution - Rear Turn and Brake Lights (C31.1 R65.1)
NetC35_1: Power Distribution - IO Expander (U11.5), Power Distribution - Rear Turn and Brake Lights (C35.1 R74.1)
NetC42_1: Power Distribution - IO Expander (U11.8), Power Distribution - Spares 1-4 5V (C42.1 R86.1)
NetC46_1: Power Distribution - IO Expander (U11.7), Power Distribution - Spares 1-4 5V (C46.1 R95.1)
NetC51_1: Power Distribution - IO Expander (U11.20), Power Distribution - Solar Sense, Telemetry, and BMS (C51.1 R105.1)
NetC53_1: Power Distribution - IO Expander (U11.2), Power Distribution - Solar Sense, Telemetry, and BMS (C53.1 R111.1)
NetC57_1: Power Distribution - IO Expander (U11.19), Power Distribution - Spares 8-9 5V (C57.1 R120.1)
NetC60_1: Power Distribution - IO Expander (U11.21), Power Distribution - Motor Interface (C60.1 R129.1)
NetR10_1: Power Distribution - IO Expander (U12.8), Power Distribution -  Rear Camera and Charger (R10.1)
NetR10_3: Power Distribution - IO Expander (U12.7), Power Distribution -  Rear Camera and Charger (R10.3)
NetR10_4: Power Distribution - IO Expander (U12.6), Power Distribution -  Rear Camera and Charger (R10.4)
NetR19_1: Power Distribution - IO Expander (U12.9), Power Distribution -  Rear Camera and Charger (R19.1)
NetR29_1: Power Distribution - IO Expander (U10.20), Power Distribution - Strobe and Center Brake Lights (R29.1)
NetR30_1: Power Distribution - IO Expander (U12.14), Power Distribution - Strobe and Center Brake Lights (R30.1)
NetR30_3: Power Distribution - IO Expander (U12.15), Power Distribution - Strobe and Center Brake Lights (R30.3)
NetR30_4: Power Distribution - IO Expander (U12.16), Power Distribution - Strobe and Center Brake Lights (R30.4)
NetR46_1: Power Distribution - IO Expander (U12.13), Power Distribution - Strobe and Center Brake Lights (R46.1)
NetR55_1: Power Distribution - IO Expander (U10.11), Power Distribution - Rear Turn and Brake Lights (R55.1)
NetR55_3: Power Distribution - IO Expander (U10.10), Power Distribution - Rear Turn and Brake Lights (R55.3)
NetR55_4: Power Distribution - IO Expander (U10.9), Power Distribution - Rear Turn and Brake Lights (R55.4)
NetR57_1: Power Distribution - IO Expander (U12.17), Power Distribution - Rear Turn and Brake Lights (R57.1)
NetR69_1: Power Distribution - IO Expander (U10.17), Power Distribution - Rear Turn and Brake Lights (R69.1)
NetR69_3: Power Distribution - IO Expander (U10.18), Power Distribution - Rear Turn and Brake Lights (R69.3)
NetR69_4: Power Distribution - IO Expander (U10.19), Power Distribution - Rear Turn and Brake Lights (R69.4)
NetR80_1: Power Distribution - IO Expander (U10.13), Power Distribution - Spares 1-4 5V (R80.1)
NetR80_3: Power Distribution - IO Expander (U10.14), Power Distribution - Spares 1-4 5V (R80.3)
NetR80_4: Power Distribution - IO Expander (U10.15), Power Distribution - Spares 1-4 5V (R80.4)
NetR89_1: Power Distribution - IO Expander (U10.8), Power Distribution - Spares 1-4 5V (R89.1)
NetR89_3: Power Distribution - IO Expander (U10.7), Power Distribution - Spares 1-4 5V (R89.3)
NetR89_4: Power Distribution - IO Expander (U10.6), Power Distribution - Spares 1-4 5V (R89.4)
NetR102_1: Power Distribution - IO Expander (U12.5), Power Distribution - Solar Sense, Telemetry, and BMS (R102.1)
NetR102_3: Power Distribution - IO Expander (U12.4), Power Distribution - Solar Sense, Telemetry, and BMS (R102.3)
NetR102_4: Power Distribution - IO Expander (U12.18), Power Distribution - Solar Sense, Telemetry, and BMS (R102.4)
NetR103_1: Power Distribution - IO Expander (U12.10), Power Distribution - Solar Sense, Telemetry, and BMS (R103.1)
NetR115_1: Power Distribution - IO Expander (U10.5), Power Distribution - Spares 8-9 5V (R115.1)
NetR115_3: Power Distribution - IO Expander (U10.4), Power Distribution - Spares 8-9 5V (R115.3)
NetR115_4: Power Distribution - IO Expander (U10.16), Power Distribution - Spares 8-9 5V (R115.4)
NetR127_1: Power Distribution - IO Expander (U12.11), Power Distribution - Motor Interface (R127.1)
PA2_MUX_EN: Controller_Board_Interface (P1.23), Power Distribution - IO Expander (U11.15)
PA3_MUX_SEL4: Controller_Board_Interface (P1.22), Power Distribution - IO Expander (U11.13)
PA4_MUX_SEL3: Controller_Board_Interface (P1.21), Power Distribution - IO Expander (U11.14)
PA5_MUX_SEL2: Controller_Board_Interface (P1.20), Power Distribution - IO Expander (U11.11)
PA6_MUX_SEL1: Controller_Board_Interface (P1.19), Power Distribution - IO Expander (U11.10)
PA7_MUX_OUTPUT: Controller_Board_Interface (P1.18), Power Distribution - IO Expander (U11.1)
PB13_IO_2_INT: Controller_Board_Interface (P1.10), Power Distribution - IO Expander (R79.2 U12.1)
PB14_IO_1_INT: Controller_Board_Interface (P1.9), Power Distribution - IO Expander (R78.2 U10.1)